# EAGLE design buck_schematic (EAGLE 7.4.0)
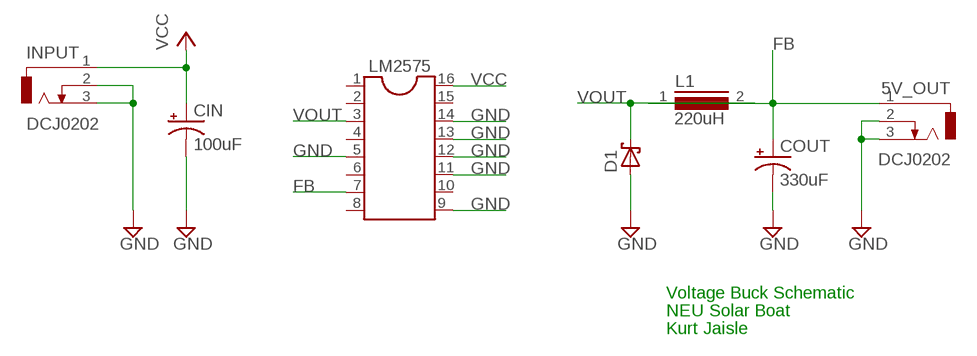
[diagram p0: schematic, sheet 1]

## Parts
5V_OUT  DCJ0202  [DCJ0202]
CIN  100uF  CPOL-USE5-10.5  [E5-10,5]
COUT  330uF  CPOL-USE5-10.5  [E5-10,5]
D1  SCHOTTKY-DIODEF126Z12  [F126Z12]
INPUT  DCJ0202  [DCJ0202]
L1  220uH  B82133  [SUKW3-27]
LM2575  DIL16  [DIL16]

## Nets
FB: 5V_OUT.1 COUT.+ L1.1 LM2575.7
GND: 5V_OUT.2 5V_OUT.3 CIN.- COUT.- D1.A INPUT.2 INPUT.3 LM2575.5 LM2575.9 LM2575.11 LM2575.12 LM2575.13 LM2575.14
VCC: CIN.+ INPUT.1 LM2575.16
VOUT: D1.C L1.2 LM2575.3
Unconnected: LM2575.1 LM2575.2 LM2575.4 LM2575.6 LM2575.8 LM2575.10 LM2575.15

## Notes on the sheet
- Voltage Buck Schematic
- NEU Solar Boat
- Kurt Jaisle

## Library data of the parts
5V_OUT INPUT = con-jack:DCJ0202: DC POWER JACK Source: DCJ0202.pdf; OC_FARNELL: unknown; OC_NEWARK: unknown
CIN COUT = rcl:CPOL-US: POLARIZED CAPACITOR, American symbol
D1 = diode:SCHOTTKY-DIODE: Schottky Diode
L1 = inductors:B82133: INDUCTOR
LM2575 = ic-package:DIL16: Dual In Line / Socket

## Board
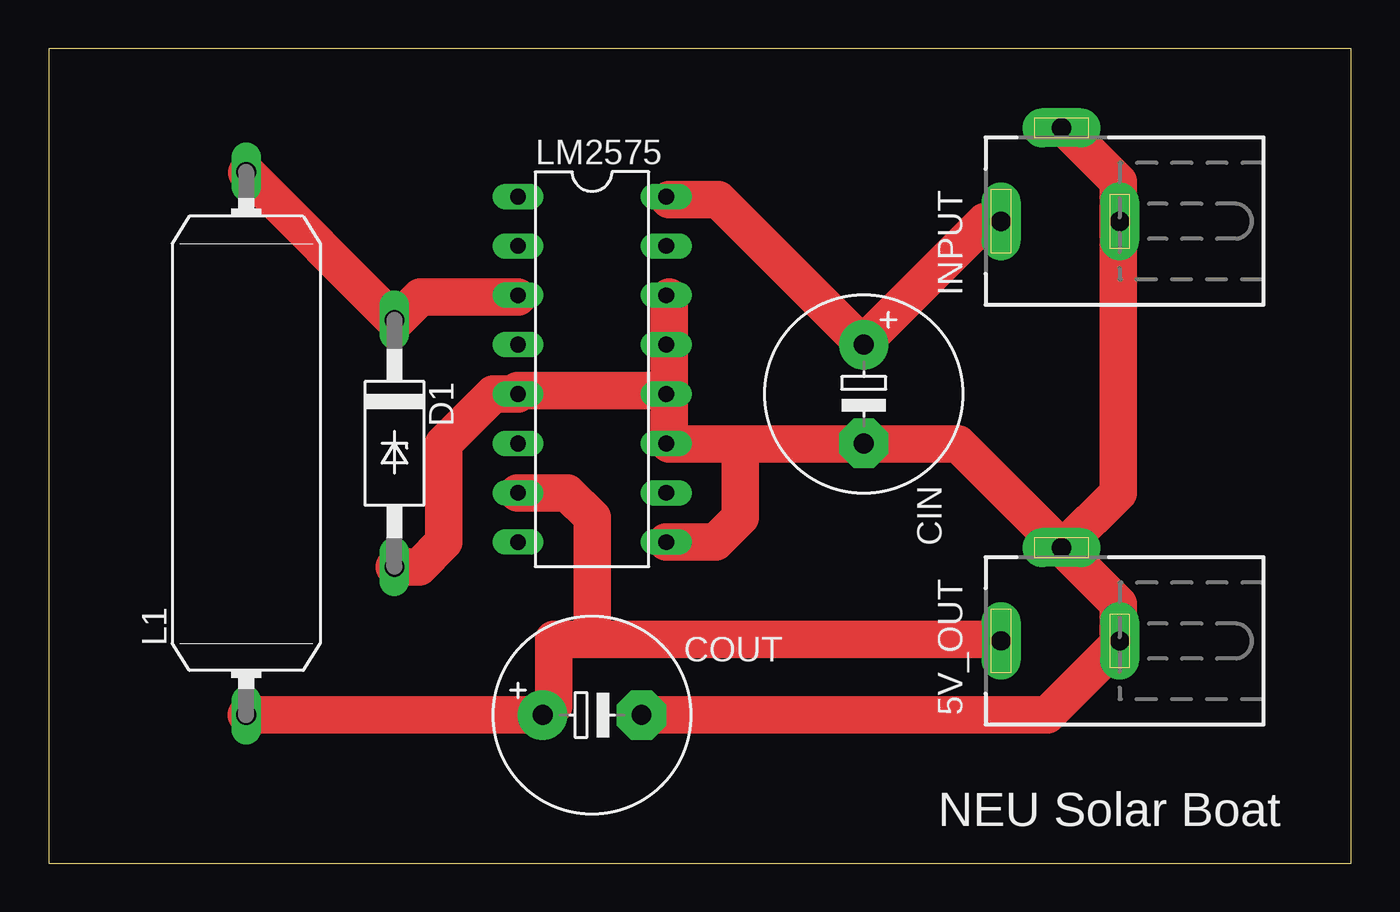
[diagram p1: board, top side]

Size 66.98 x 41.9 mm. Coordinates in mm from the lower left corner, seen from the top.
Outline: 0,0 66.98,0 66.98,41.9 0,41.9 0,0
Copper layers (1*16): Top 0.035mm / dielectric 1.5mm / Bottom 0.035mm
Design rules "default": minimum track width 10mil, minimum drill 24mil, track to track 8mil, track to pad 8mil, pad to pad 8mil, via to via 8mil, smd to smd 8mil, copper to edge 40mil, drill to drill 8mil, minimum pad ring 10mil, minimum via ring 8mil, stop-mask expansion 4mil, vias tented up to drill 0mil, thermal gap 10mil

### Footprints (pad centres in the part's own frame; a part is rotated, then mirrored left to right if it is on the bottom)
DCJ0202 = drill 1 pad 2 long: 1 0,3.1; 2 4.8,0; 3 0,-3
E5-10,5 = drill 1.016 pad 2.54: + -2.54,0 | drill 1.016 pad 2.54 octagon: - 2.54,0
F126Z12 = drill 1.016 long: A 6.35,0; C -6.35,0
SUKW3-27 = drill 1.016 long: 1 -13.97,0; 2 13.97,0
DIL16 = drill 0.813 long: 1 -8.89,-3.81; 2 -6.35,-3.81; 3 -3.81,-3.81; 4 -1.27,-3.81; 5 1.27,-3.81; 6 3.81,-3.81; 7 6.35,-3.81; 8 8.89,-3.81; 9 8.89,3.81; 10 6.35,3.81; 11 3.81,3.81; 12 1.27,3.81; 13 -1.27,3.81; 14 -3.81,3.81; 15 -6.35,3.81; 16 -8.89,3.81

### Placement (x,y rotation side)
5V_OUT  52.07,11.43 90 top
CIN  41.91,24.13 270 top
COUT  27.94,7.62 0 top
D1  17.78,21.59 270 top
INPUT  52.07,33.02 90 top
L1  10.16,21.59 90 top
LM2575  27.94,25.4 270 top

### Tracks (layer width: path | path; a pad name or v marks a point on that pad's centre or on a via)
FB
  Top 0.254: 25.96,8.08 25.5,7.62 COUT.+ | 48.82,11.51 5V_OUT.1
  Top 1.93: 25.96,8.08 25.96,11.51 27.94,11.51 | COUT.+ L1.1 | 27.94,11.51 48.82,11.51 | LM2575.7 26.67,19.05 27.94,17.78 27.94,11.51
GND
  Top 0.254: 31.9,21.56 LM2575.11 31.9,21.79 | 31.9,26.82 LM2575.13 31.9,26.59 | 31.9,29.11 LM2575.14 | 24.13,24.31 LM2575.5 24.13,24.08 | 31.67,24.31 LM2575.12 | 31.9,24.31 LM2575.12 | 31.9,24.08 LM2575.12 | 41.73,21.56 CIN.- 41.96,21.56 | 54.99,33.22 INPUT.3 54.99,32.99 | 52.25,37.79 INPUT.2 | 54.99,11.51 5V_OUT.3 54.99,11.28 | 52.25,16.08 5V_OUT.2 | 52.25,16.31 5V_OUT.2 | 52.02,16.31 5V_OUT.2
  Top 1.93: 31.9,29.11 31.9,26.82 | 31.67,24.31 24.13,24.31 | 31.9,24.31 31.9,26.59 | 31.9,24.08 31.9,21.79 | 31.9,21.56 35.56,21.56 | 35.56,21.56 41.73,21.56 | 54.99,33.22 54.99,35.05 52.25,37.79 | 54.99,11.51 54.99,13.34 52.25,16.08 | COUT.- 51.33,7.62 54.99,11.28 | 54.99,32.99 54.99,19.05 52.25,16.31 | 41.96,21.56 46.76,21.56 52.02,16.31 | D1.A 19.05,15.24 20.32,16.51 20.32,21.59 22.86,24.13 LM2575.5 | LM2575.9 34.29,16.51 35.56,17.78 35.56,21.56
VCC
  Top 0.254: 31.9,34.14 LM2575.16 | 41.73,26.82 CIN.+ 41.96,26.82 | 48.13,32.99 48.82,32.99
  Top 1.93: 31.9,34.14 34.42,34.14 41.73,26.82 | 41.96,26.82 48.13,32.99 | 48.82,32.99 INPUT.1
VOUT
  Top 0.254: 24.13,29.11 LM2575.3 | 17.96,27.96 D1.C 17.73,27.96 | 10.18,35.51 L1.2
  Top 1.93: 24.13,29.11 19.1,29.11 17.96,27.96 | 17.73,27.96 10.18,35.51

### Text on the board
tPlace: NEU Solar Boat